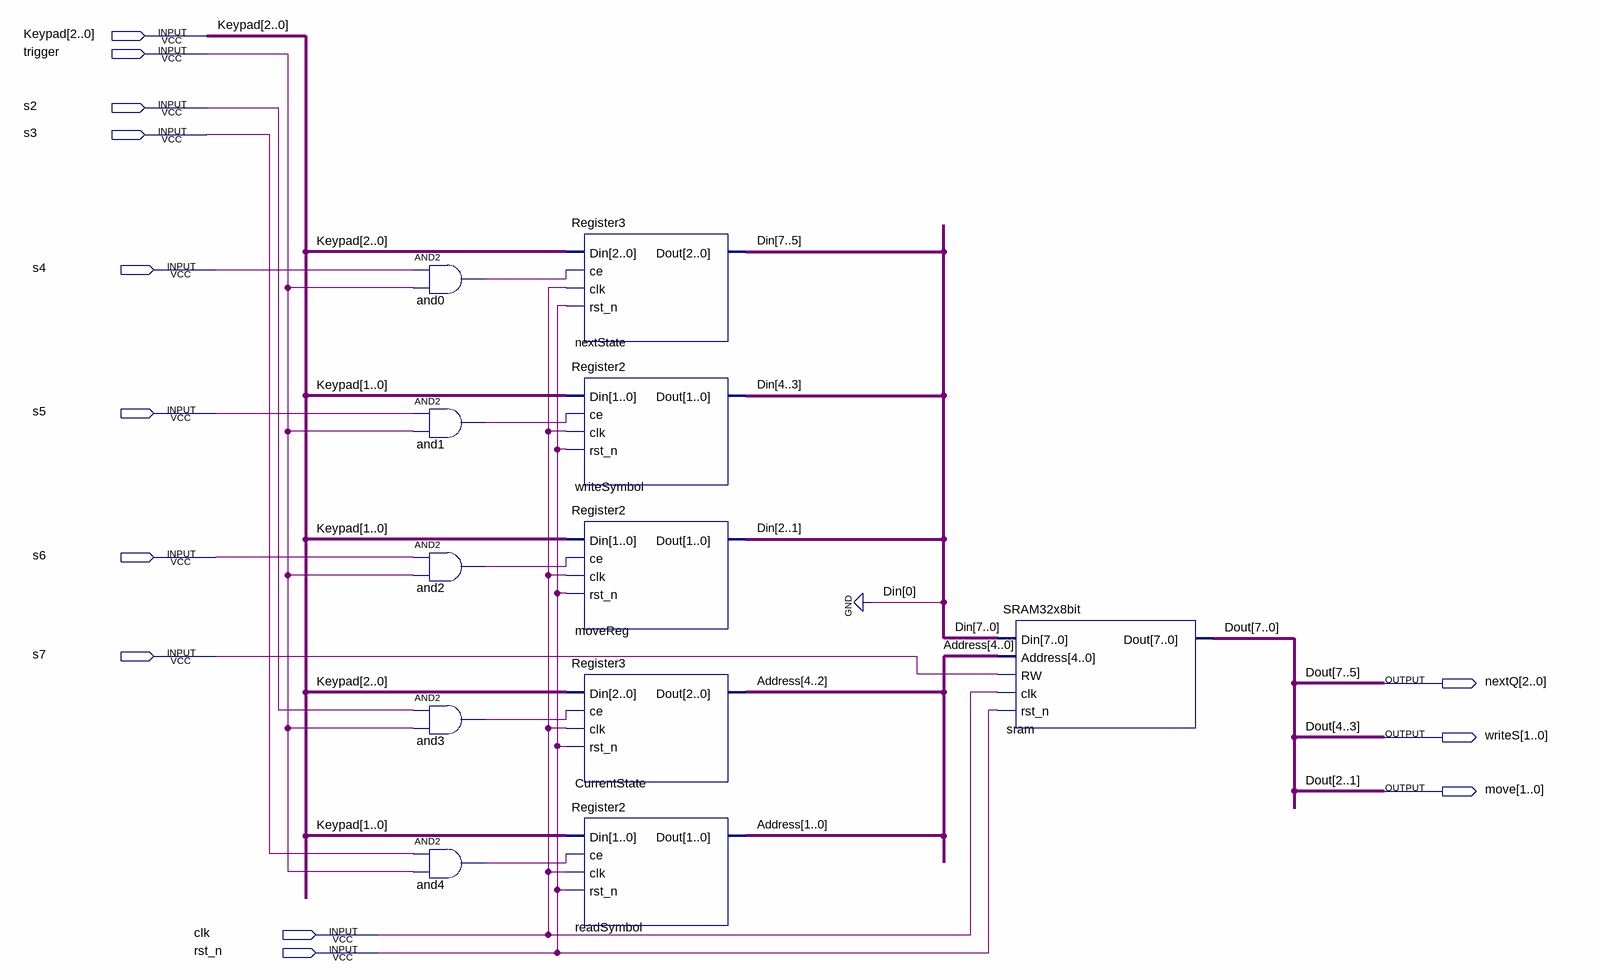
[diagram p0: schematic sheet]
// Quartus schematic TableRegister.bdf as structural Verilog: 11 symbols, 13 pins
module TableRegister (
  input  [2:0] Keypad,
  input  trigger,
  input  s2,
  input  s3,
  input  s4,
  input  s5,
  input  s6,
  input  s7,
  input  clk,
  input  rst_n,
  output [2:0] nextQ,
  output [1:0] writeS,
  output [1:0] move
);

  wire and0_out, and1_out, and2_out, and3_out, and4_out;
  wire [0:0] Dout;
  wire [4:0] Address;
  wire [7:1] Din;

  and and0 (and0_out, s4, trigger);
  and and1 (and1_out, s5, trigger);
  and and2 (and2_out, s6, trigger);
  and and3 (and3_out, s2, trigger);
  and and4 (and4_out, s3, trigger);
  Register3 nextState (.Din(Keypad), .ce(and0_out), .clk(clk), .rst_n(rst_n), .Dout(Din[7:5]));
  Register2 writeSymbol (.Din(Keypad[1:0]), .ce(and1_out), .clk(clk), .rst_n(rst_n), .Dout(Din[4:3]));
  Register2 moveReg (.Din(Keypad[1:0]), .ce(and2_out), .clk(clk), .rst_n(rst_n), .Dout(Din[2:1]));
  Register3 CurrentState (.Din(Keypad), .ce(and3_out), .clk(clk), .rst_n(rst_n), .Dout(Address[4:2]));
  Register2 readSymbol (.Din(Keypad[1:0]), .ce(and4_out), .clk(clk), .rst_n(rst_n), .Dout(Address[1:0]));
  SRAM32x8bit sram (
    .Din({Din, 1'b0}), .Address(Address), .RW(s7), .clk(clk), .rst_n(rst_n),
    .Dout({nextQ, writeS, move, Dout[0]}));

  // Other names for the same wires on the sheet: Dout[7:1] = {nextQ, writeS, move}
endmodule
